# Altium schematic sheet PWMDriver.SchDoc
size A
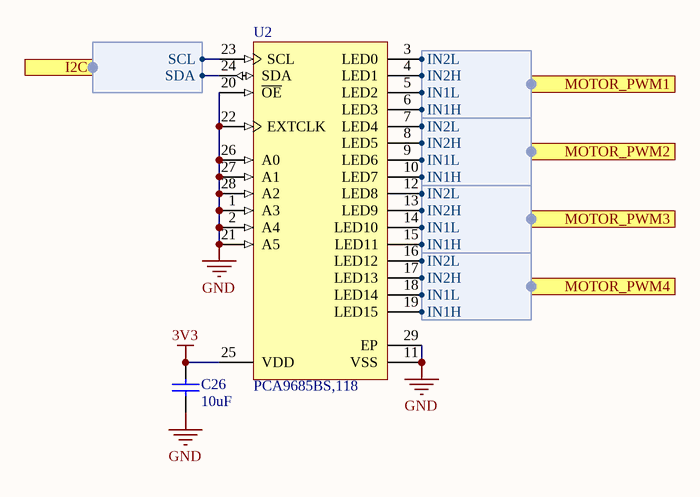
[diagram p0: PWMDriver.SchDoc]

## Parts
C26  value 10uF  [C0402[1005X55]]  (hidden comment: 10uF 6.3V 0402)
U2  PCA9685BS,118  [VQFN-28]

## Ports
I2C (harness I2C), MOTOR_PWM1 (harness MotorPWM), MOTOR_PWM2 (harness MotorPWM), MOTOR_PWM3 (harness MotorPWM), MOTOR_PWM4 (harness MotorPWM)

## Harnesses
I2C: SCL, SDA
MotorPWM: IN1H, IN1L, IN2H, IN2L

## Nets
3V3: C26.2 U2.25(VDD)
GND: C26.1 U2.1(A3) U2.2(A4) U2.11(VSS) U2.20(~{OE}) U2.21(A5) U2.22(EXTCLK) U2.26(A0) U2.27(A1) U2.28(A2) U2.29(EP)
NetU2_3: U2.3(LED0) ; port MOTOR_PWM1.IN2L
NetU2_4: U2.4(LED1) ; port MOTOR_PWM1.IN2H
NetU2_5: U2.5(LED2) ; port MOTOR_PWM1.IN1L
NetU2_6: U2.6(LED3) ; port MOTOR_PWM1.IN1H
NetU2_7: U2.7(LED4) ; port MOTOR_PWM2.IN2L
NetU2_8: U2.8(LED5) ; port MOTOR_PWM2.IN2H
NetU2_9: U2.9(LED6) ; port MOTOR_PWM2.IN1L
NetU2_10: U2.10(LED7) ; port MOTOR_PWM2.IN1H
NetU2_12: U2.12(LED8) ; port MOTOR_PWM3.IN2L
NetU2_13: U2.13(LED9) ; port MOTOR_PWM3.IN2H
NetU2_14: U2.14(LED10) ; port MOTOR_PWM3.IN1L
NetU2_15: U2.15(LED11) ; port MOTOR_PWM3.IN1H
NetU2_16: U2.16(LED12) ; port MOTOR_PWM4.IN2L
NetU2_17: U2.17(LED13) ; port MOTOR_PWM4.IN2H
NetU2_18: U2.18(LED14) ; port MOTOR_PWM4.IN1L
NetU2_19: U2.19(LED15) ; port MOTOR_PWM4.IN1H
NetU2_23: U2.23(SCL) ; port I2C.SCL
NetU2_24: U2.24(SDA) ; port I2C.SDA

## Library data of the parts
C26 = CAP_10uF_6.3V_0402_20%: 10uF 6.3V 20% 0402 (1005 Metric); PartNumber: GRM155R60J106ME44D; Manufacturer: Murata; Mounting Technology: Surface Mount; PackageReference: 0402; PackageDescription: 0402 (1005 Metric); Voltage: 6.3V; Tolerance: 20%
U2 = PCA9685BS,118: IC LED DRVR LIN DIM 25MA 28HVQFN; Manufacturer: NXP; PartNumber: PCA9685BS,118; PackageReference: QFN-28; Mounting Technology: Surface Mount